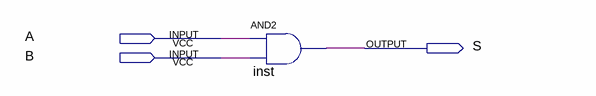
[diagram p0: schematic sheet]
// Quartus schematic and_port.bdf as structural Verilog: 1 symbols, 3 pins
module and_port (
  input  A,
  input  B,
  output S
);

  and inst (S, A, B);
endmodule
